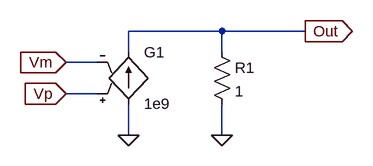
[diagram p0: schematic op_amp.asc]
op_amp.asc, the LTspice schematic file:
Version 4
SHEET 1 880 680
WIRE 304 176 160 176
WIRE 432 176 304 176
WIRE 160 208 160 176
WIRE 304 208 304 176
WIRE 112 224 64 224
WIRE 112 272 64 272
WIRE 160 336 160 288
WIRE 304 336 304 288
FLAG 160 336 0
FLAG 304 336 0
FLAG 64 224 Vm
IOPIN 64 224 In
FLAG 64 272 Vp
IOPIN 64 272 In
FLAG 432 176 Out
IOPIN 432 176 Out
SYMBOL g2 160 192 R0
SYMATTR InstName G1
SYMATTR Value 1e9
SYMBOL res 288 192 R0
SYMATTR InstName R1
SYMATTR Value 1

The netlist it stands for:
* op_amp.asc
G1 0 Out Vp Vm 1e9
R1 Out 0 1
.backanno
.end